# Altium schematic sheet Ethernet.SchDoc
size A; SheetNumber: 6; SheetTotal: 10
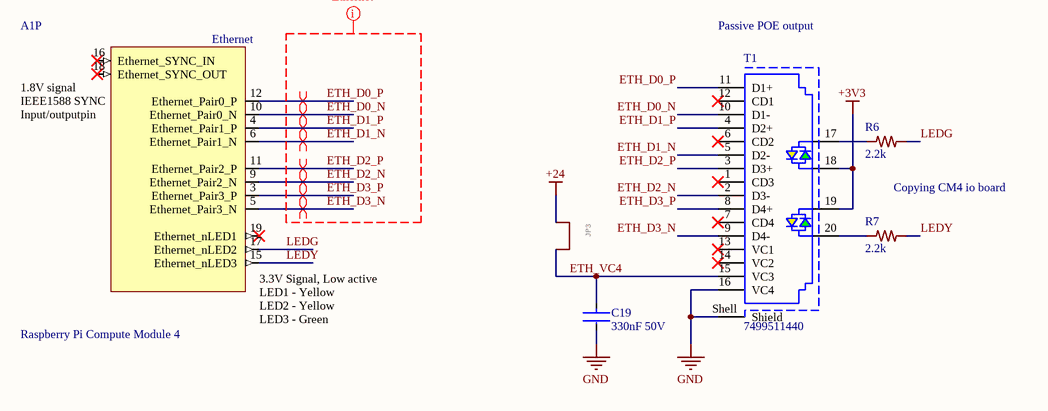
[diagram p0: Ethernet.SchDoc]

## Parts
A1  Raspberry Pi Compute Module 4  [CM4-F40C-100DS-0.4v_1.5mm_0mm]  (part P of 21)  (no BOM)
C19  330nF 50V  [CAPACITOR_0603]
JP3  TSM-102-01-L-SV  [FP-TSM-102-01-L-SV-P-TR-MFG]  (value not drawn)
R6  RESISTANCE: 2.2k  [0603R]  (hidden comment: Resistor 0603)
R7  RESISTANCE: 2.2k  [0603R]  (hidden comment: Resistor 0603)
T1  7499511440  [7499511440]

## Nets
+3V3: T1.18 T1.19
+24: JP3.1
GND: C19.1 T1.16(VC4) T1.Shell(Shield)
ETH_D0_N: A1.10(Ethernet_Pair0_N) T1.10(D1-)
ETH_D0_P: A1.12(Ethernet_Pair0_P) T1.11(D1+)
ETH_D1_N: A1.6(Ethernet_Pair1_N) T1.5(D2-)
ETH_D1_P: A1.4(Ethernet_Pair1_P) T1.4(D2+)
ETH_D2_N: A1.9(Ethernet_Pair2_N) T1.2(D3-)
ETH_D2_P: A1.11(Ethernet_Pair2_P) T1.3(D3+)
ETH_D3_N: A1.5(Ethernet_Pair3_N) T1.9(D4-)
ETH_D3_P: A1.3(Ethernet_Pair3_P) T1.8(D4+)
ETH_VC4: C19.2 JP3.2 T1.15(VC3)
LEDG: A1.17(Ethernet_nLED2) R6.2
LEDY: A1.15(Ethernet_nLED3) R7.2
NetR6_1: R6.1 T1.17
NetR7_1: R7.1 T1.20

Not connected (* = marked no-connect by the designer): A1 16(Ethernet_SYNC_IN)* 18(Ethernet_SYNC_OUT)* 19(Ethernet_nLED1)*; T1 1(CD3)* 6(CD2)* 7(CD4)* 12(CD1)* 13(VC1)* 14(VC2)*

## Layout directives
differential pair: ETH_D0_N, ETH_D0_P, ETH_D1_N, ETH_D1_P, ETH_D2_N, ETH_D2_P, ETH_D3_N, ETH_D3_P
net class Ethernet: ETH_D0_N, ETH_D0_P, ETH_D1_N, ETH_D1_P, ETH_D2_N, ETH_D2_P, ETH_D3_N, ETH_D3_P

## Notes on the sheet
- Passive POE output
- Copying CM4 io board
- (in symbol CM4, part P) Ethernet; 1.8V signal / IEEE1588 SYNC Input/outputpin; by Amornthep Phunsin; 3.3V Signal, Low active / LED1 - Yellow / LED2 - Yellow / LED3 - Green

## Library data of the parts
A1 = CM4: Raspberry Pi Compute Module 4 by Amornthep Phunsin; MPN: -
C19 = C1608X7R1H334K080AC: CAP CER 0.33UF 50V X7R 0603; MFR: TDK Corporation; Tolerance: 10%; Dielectric Material: Ceramic; Capacitance: 330nF; Case Code (Imperial): 0603; Case Code (Metric): 1608; Dielectric: X7R; Length: 1.6mm; Construction: Flat; Resistor Type: Ceramic; Mount: Surface Mount; Voltage Rating: 50V; Packaging: Tape and Reel; Series: C; Case/Package: 0603; Lead Free: Lead Free; Voltage: 50V; REACH SVHC: No SVHC; Height: 0.8mm; Weight: 7.1E-05oz; Termination: SMD/SMT; Max Operating Temperature: 125°C; RoHS Compliant: Yes; Min Operating Temperature: -55°C; Depth: 0.8mm; Package Quantity: 1; Thickness: 0.037inch; Voltage Rating (DC): 50V; Width: 0.031inch; MPN: C1608X7R1H334K080AC
JP3 = JUMPER_?_SMD_2POS: CONN HEADER SMD 2POS 2.54MM; MANUFACTURER: Samtec Inc.; GateName_1: G$1; SymbolName_1: JUMPER; MPN: TSM-102-01-L-SV; MFR: Samtec Inc.
R6 R7 = RESISTOR_0603: MPN: RT0603BRD072K2L; MFR: YAGEO; GateName_1: G$1; DeviceName: 0603; SymbolName_1: RESISTOR; DPKN: *; MANUFACTURER: *; MOPN: *; POWER: *; VOLTAGE_CONTINUOUS: *; VOLTAGE_MAX: *
T1 = CMP-03913-30832512-2: Telecom and Datacom Connector; Manufacturer: Wurth Electronics; Color: Green, Yellow; Pitch: 2.54mm; Insertion Loss (dB): -1.2dB; Gender: Female; Shielding: Shielded; Number of Positions: 8; Inductance: 350µH; Connector Type: RJ45; Direction: Up; Number of Ports: 1; REACH SVHC: Unknown; Min Operating Temperature: -40°C; Mount: Through Hole; NexarPartId: 30832512; Housing Material: Thermoplastic; Termination: Through Hole; Number of Rows: 1; Lead Free: Lead Free; RoHS: Compliant; Flammability Rating: UL94 V-0; Width: 17mm; Height: 13.87mm; Number of Cores per Jack: 8; Max Operating Temperature: 85°C; Contact Plating: Gold; Number of Contacts: 8; Contact Material: Ferrite, Gold, Tin; Length: 33.02mm; Supplier: Digi-Key; Supplier Part Number: 732-4965-ND; Category: Modular / Ethernet Connectors; Stock: 1682; Pricing: 1=14.96, 10=14.709, 50=13.659, 100=12.608, 500=11.55804 (USD); Contact Finish - Mating: GOLD (30); Contact Finish - Termination: TIN OVER NICKEL; JESD-609 Code: e3; Reach SVHC Compliant: No; RoHS Compliant: Yes; ComponentLink1URL: https://datasheet.ciiva.com:443/pdfs/VipMasterIC/IC/MIDC/MIDC-S-A0004025553/MIDC-S-A0004711821-1.pdf?src-supplier=IHS+Markit; ComponentLink1Description: https://datasheet.ciiva.com:443/pdfs/VipMasterIC/IC/MIDC/MIDC-S-A0004025553/MIDC-S-A0004711821-1.pdf?src-supplier=IHS+Markit; ComponentLink2URL: https://datasheet.ciiva.com/24091/7499511440-254189-24091260.pdf?src-supplier=Mouser; ComponentLink2Description: https://datasheet.ciiva.com/24091/7499511440-254189-24091260.pdf?src-supplier=Mouser; ComponentLink3URL: https://datasheet.ciiva.com/22749/1737251-22749408.pdf?src-supplier=Element14; ComponentLink3Description: https://datasheet.ciiva.com/22749/1737251-22749408.pdf?src-supplier=Element14; ComponentLink4URL: https://datasheet.ciiva.com/29167/7499511440-29167180.pdf?src-supplier=Digi-Key; ComponentLink4Description: https://datasheet.ciiva.com/29167/7499511440-29167180.pdf?src-supplier=Digi-Key; MPN: 7499511440; MFR: Wurth Electronics